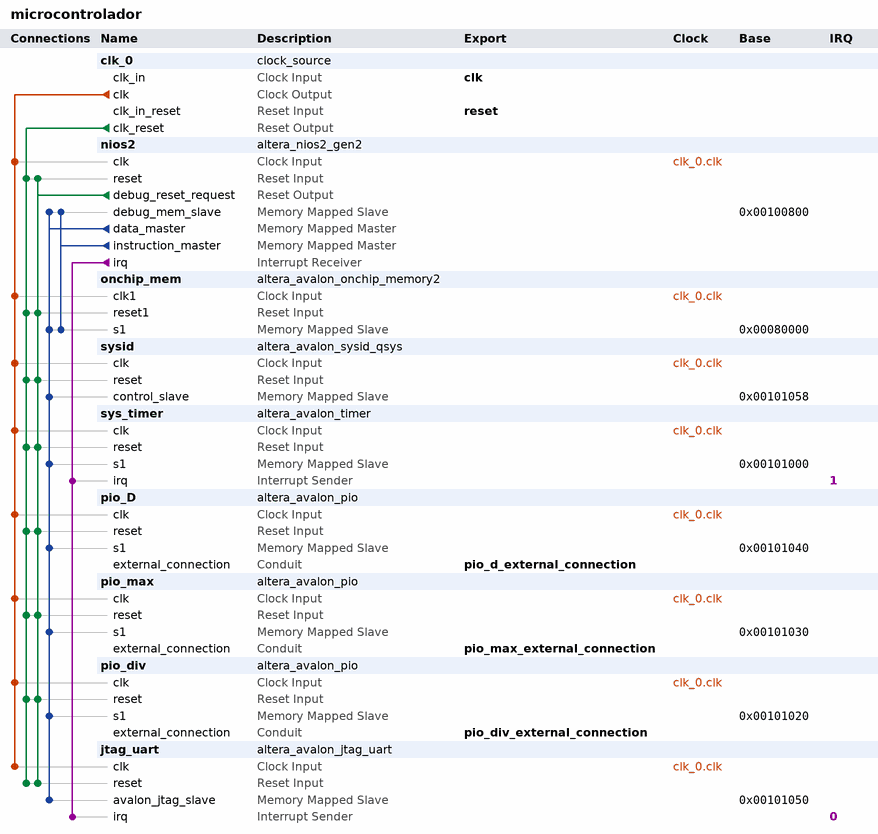
[diagram p0: system contents]
# Platform Designer (Qsys) system microcontrolador, Cyclone IV E EP4CE115F29C7
# Parameters at their usual value, and those the tool derives, are not listed.
package require -exact qsys 20.1
create_system microcontrolador
set_project_property DEVICE_FAMILY {Cyclone IV E}
set_project_property DEVICE EP4CE115F29C7

add_instance clk_0 clock_source 20.1
set_instance_parameter_value clk_0 clockFrequency 50000000

add_instance nios2 altera_nios2_gen2 20.1
set_instance_parameter_value nios2 dcache_size 2048
set_instance_parameter_value nios2 exceptionSlave onchip_mem.s1
set_instance_parameter_value nios2 icache_size 4096
set_instance_parameter_value nios2 impl Tiny
set_instance_parameter_value nios2 resetSlave onchip_mem.s1

add_instance onchip_mem altera_avalon_onchip_memory2 20.1
set_instance_parameter_value onchip_mem dataWidth 32
set_instance_parameter_value onchip_mem dualPort false
set_instance_parameter_value onchip_mem initMemContent true
set_instance_parameter_value onchip_mem initializationFileName onchip_mem.hex
set_instance_parameter_value onchip_mem memorySize 400000

add_instance sysid altera_avalon_sysid_qsys 20.1
set_instance_parameter_value sysid id 10

add_instance sys_timer altera_avalon_timer 20.1
set_instance_parameter_value sys_timer period 1
set_instance_parameter_value sys_timer periodUnits MSEC

add_instance pio_D altera_avalon_pio 20.1
set_instance_parameter_value pio_D direction Output
set_instance_parameter_value pio_D width 32

add_instance pio_max altera_avalon_pio 20.1
set_instance_parameter_value pio_max direction Output
set_instance_parameter_value pio_max width 32

add_instance pio_div altera_avalon_pio 20.1
set_instance_parameter_value pio_div direction Output
set_instance_parameter_value pio_div width 3

add_instance jtag_uart altera_avalon_jtag_uart 20.1
set_instance_parameter_value jtag_uart simInteractiveOptions NO_INTERACTIVE_WINDOWS

# connections
add_connection clk_0.clk jtag_uart.clk clock
add_connection clk_0.clk nios2.clk clock
add_connection clk_0.clk onchip_mem.clk1 clock
add_connection clk_0.clk pio_D.clk clock
add_connection clk_0.clk pio_div.clk clock
add_connection clk_0.clk pio_max.clk clock
add_connection clk_0.clk sys_timer.clk clock
add_connection clk_0.clk sysid.clk clock
add_connection clk_0.clk_reset jtag_uart.reset reset
add_connection clk_0.clk_reset nios2.reset reset
add_connection clk_0.clk_reset onchip_mem.reset1 reset
add_connection clk_0.clk_reset pio_D.reset reset
add_connection clk_0.clk_reset pio_div.reset reset
add_connection clk_0.clk_reset pio_max.reset reset
add_connection clk_0.clk_reset sys_timer.reset reset
add_connection clk_0.clk_reset sysid.reset reset
add_connection nios2.debug_reset_request jtag_uart.reset reset
add_connection nios2.debug_reset_request nios2.reset reset
add_connection nios2.debug_reset_request onchip_mem.reset1 reset
add_connection nios2.debug_reset_request pio_D.reset reset
add_connection nios2.debug_reset_request pio_div.reset reset
add_connection nios2.debug_reset_request pio_max.reset reset
add_connection nios2.debug_reset_request sys_timer.reset reset
add_connection nios2.debug_reset_request sysid.reset reset
add_connection nios2.data_master jtag_uart.avalon_jtag_slave avalon
set_connection_parameter_value nios2.data_master/jtag_uart.avalon_jtag_slave baseAddress 0x00101050
add_connection nios2.data_master nios2.debug_mem_slave avalon
set_connection_parameter_value nios2.data_master/nios2.debug_mem_slave baseAddress 0x00100800
add_connection nios2.data_master onchip_mem.s1 avalon
set_connection_parameter_value nios2.data_master/onchip_mem.s1 baseAddress 0x00080000
add_connection nios2.data_master pio_D.s1 avalon
set_connection_parameter_value nios2.data_master/pio_D.s1 baseAddress 0x00101040
add_connection nios2.data_master pio_div.s1 avalon
set_connection_parameter_value nios2.data_master/pio_div.s1 baseAddress 0x00101020
add_connection nios2.data_master pio_max.s1 avalon
set_connection_parameter_value nios2.data_master/pio_max.s1 baseAddress 0x00101030
add_connection nios2.data_master sys_timer.s1 avalon
set_connection_parameter_value nios2.data_master/sys_timer.s1 baseAddress 0x00101000
add_connection nios2.data_master sysid.control_slave avalon
set_connection_parameter_value nios2.data_master/sysid.control_slave baseAddress 0x00101058
add_connection nios2.instruction_master nios2.debug_mem_slave avalon
set_connection_parameter_value nios2.instruction_master/nios2.debug_mem_slave baseAddress 0x00100800
add_connection nios2.instruction_master onchip_mem.s1 avalon
set_connection_parameter_value nios2.instruction_master/onchip_mem.s1 baseAddress 0x00080000
add_connection nios2.irq jtag_uart.irq interrupt
set_connection_parameter_value nios2.irq/jtag_uart.irq irqNumber 0
add_connection nios2.irq sys_timer.irq interrupt
set_connection_parameter_value nios2.irq/sys_timer.irq irqNumber 1

# exported interfaces
add_interface clk clock sink
set_interface_property clk EXPORT_OF clk_0.clk_in
add_interface pio_d_external_connection conduit end
set_interface_property pio_d_external_connection EXPORT_OF pio_D.external_connection
add_interface pio_div_external_connection conduit end
set_interface_property pio_div_external_connection EXPORT_OF pio_div.external_connection
add_interface pio_max_external_connection conduit end
set_interface_property pio_max_external_connection EXPORT_OF pio_max.external_connection
add_interface reset reset sink
set_interface_property reset EXPORT_OF clk_0.clk_in_reset

set_interconnect_requirement {$system} qsys_mm.clockCrossingAdapter HANDSHAKE
set_interconnect_requirement {$system} qsys_mm.enableEccProtection FALSE
set_interconnect_requirement {$system} qsys_mm.insertDefaultSlave FALSE
set_interconnect_requirement {$system} qsys_mm.maxAdditionalLatency 1

save_system microcontrolador.qsys
